# EAGLE schematic bbstghs_esp12F_module (EAGLE 5.09)
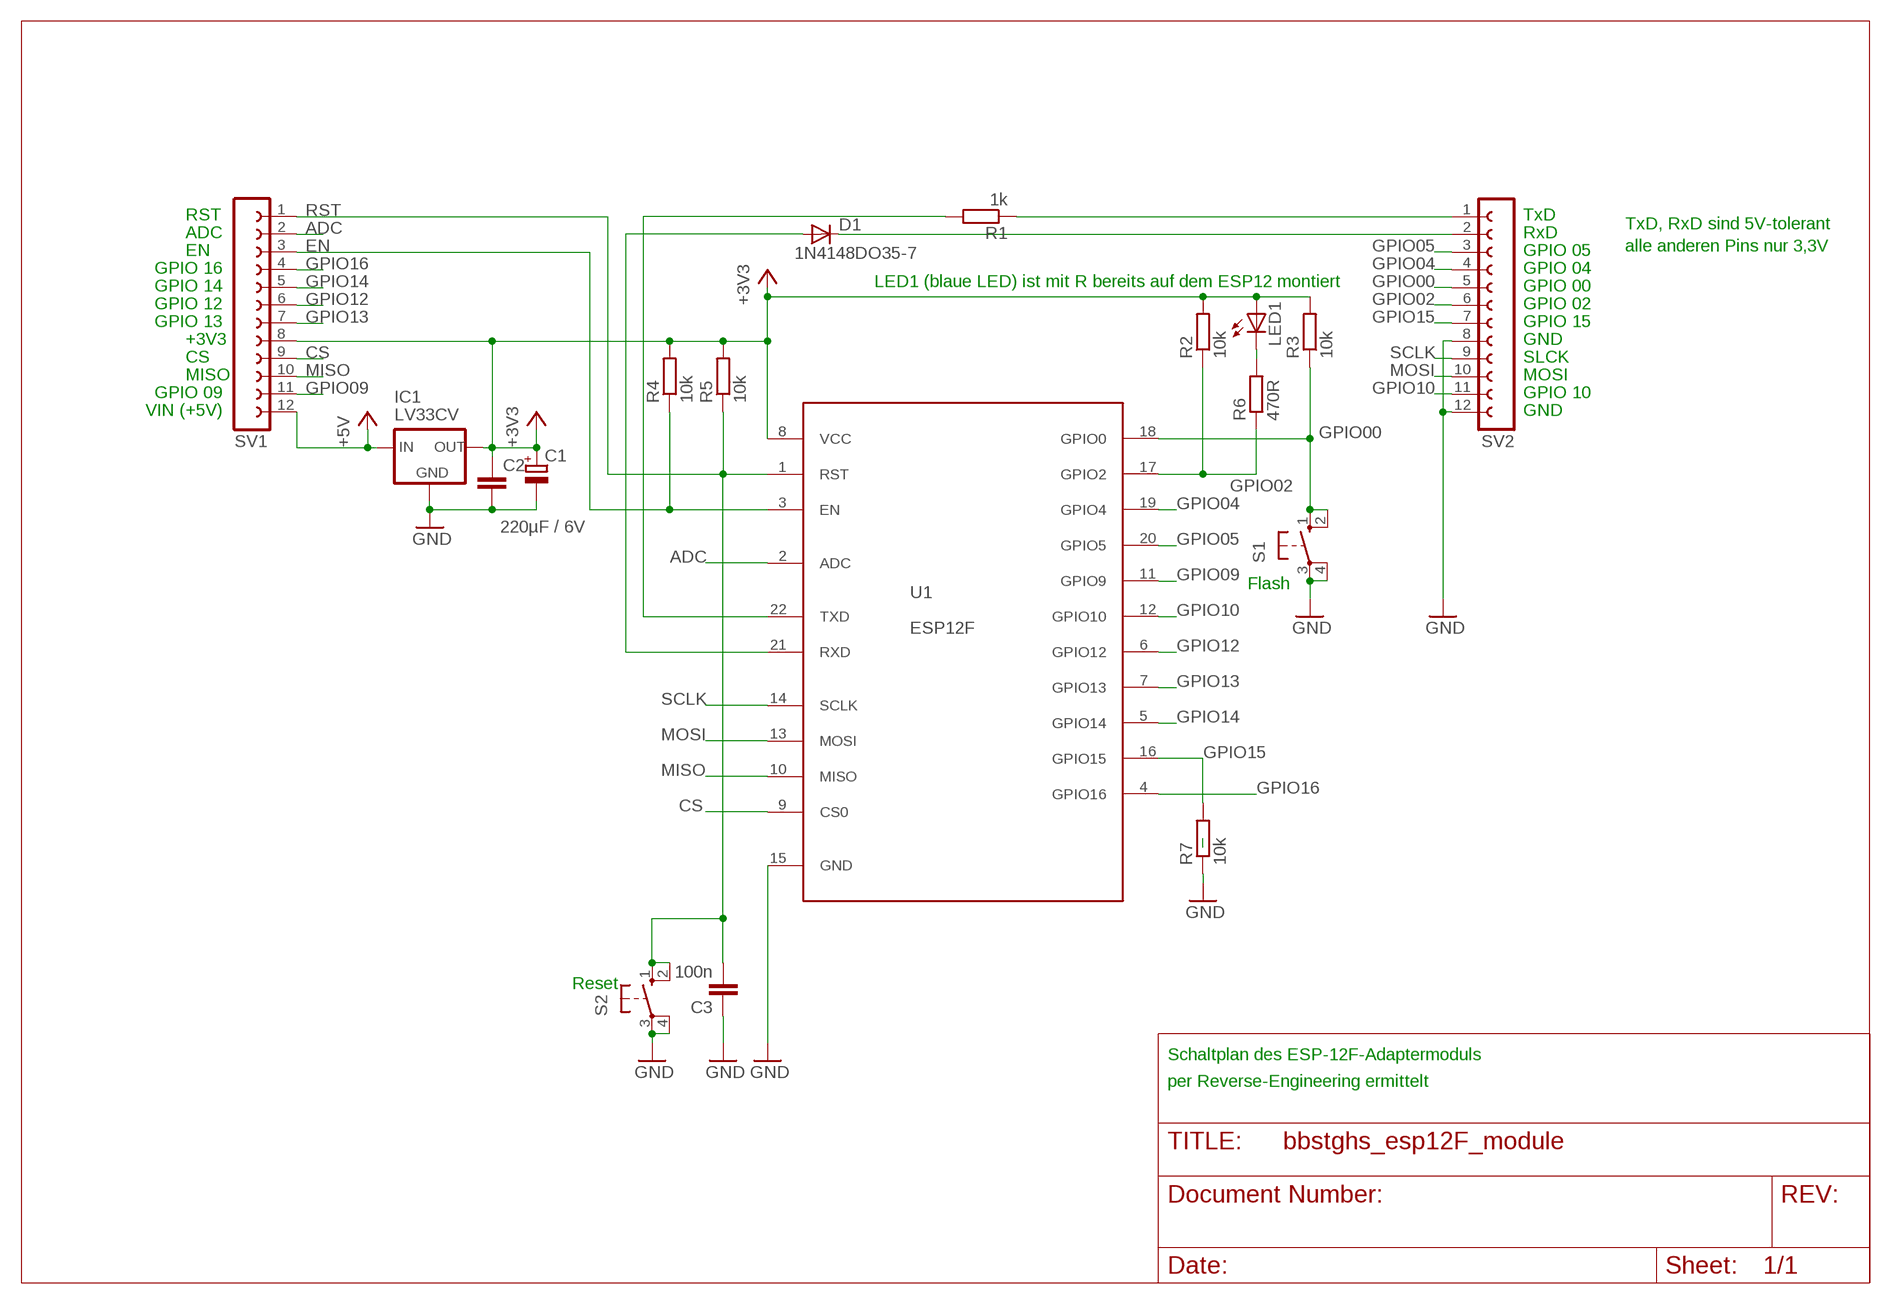
[diagram p0: schematic, sheet 1]

## Parts
C1  220µF / 6V  CPOL-EUE2-5  [E2-5]
C2  C-EU050-030X075  [C050-030X075]
C3  100n  C-EU050-030X075  [C050-030X075]
D1  1N4148DO35-7  [DO35-7]
IC1  LV33CV  78XXS  [78XXS]
LED1  LED3MM  [LED3MM]
R1  1k  R-EU_0207/10  [0207/10]
R2  10k  R-EU_0207/10  [0207/10]
R3  10k  R-EU_0207/10  [0207/10]
R4  10k  R-EU_0207/10  [0207/10]
R5  10k  R-EU_0207/10  [0207/10]
R6  470R  R-EU_0207/10  [0207/10]
R7  10k  R-EU_0207/10  [0207/10]
S1  10-XX  [B3F-10XX]
S2  10-XX  [B3F-10XX]
SV1  FE12-1  [FE12]
SV2  FE12-1  [FE12]
U1  ESP12F  [ESP12F]

## Nets
+3V3: C1.+ C2.1 IC1.OUT LED1.A R2.2 R3.2 R4.2 R5.2 SV1.8 U1.8(VCC)
+5V: IC1.IN SV1.12
ADC: SV1.2 U1.2(ADC)
CS: SV1.9 U1.9(CS0)
EN: R4.1 SV1.3 U1.3(EN)
GND: C1.- C2.2 C3.1 IC1.GND R7.1 S1.3(P) S1.4(P1) S2.3(P) S2.4(P1) SV2.8 SV2.12 U1.15(GND)
GPIO00: R3.1 S1.1(S) S1.2(S1) SV2.5 U1.18(GPIO0)
GPIO02: R2.1 R6.1 SV2.6 U1.17(GPIO2)
GPIO04: SV2.4 U1.19(GPIO4)
GPIO05: SV2.3 U1.20(GPIO5)
GPIO09: SV1.11 U1.11(GPIO9)
GPIO10: SV2.11 U1.12(GPIO10)
GPIO12: SV1.6 U1.6(GPIO12)
GPIO13: SV1.7 U1.7(GPIO13)
GPIO14: SV1.5 U1.5(GPIO14)
GPIO15: R7.2 SV2.7 U1.16(GPIO15)
GPIO16: SV1.4 U1.4(GPIO16)
MISO: SV1.10 U1.10(MISO)
MOSI: SV2.10 U1.13(MOSI)
N$4: LED1.K(C) R6.2
N$12: R1.1 SV2.1
N$13: R1.2 U1.22(TXD)
N$16: D1.C SV2.2
N$17: D1.A U1.21(RXD)
RST: C3.2 R5.1 S2.1(S) S2.2(S1) SV1.1 U1.1(RST)
SCLK: SV2.9 U1.14(SCLK)

## Notes on the sheet
- RST | TxD
- TxD, RxD sind 5V-tolerant
- ADC | RxD
- EN | GPIO 05 | alle anderen Pins nur 3,3V
- GPIO 16 | GPIO 04
- GPIO 14 | LED1 (blaue LED) ist mit R bereits auf dem ESP12 montiert | GPIO 00
- GPIO 12 | GPIO 02
- GPIO 13 | GPIO 15
- +3V3 | GND
- CS | SLCK
- MISO | MOSI
- GPIO 09 | GPIO 10
- VIN (+5V) | GND
- Flash
- Reset
- Schaltplan des ESP-12F-Adaptermoduls
- per Reverse-Engineering ermittelt

## Library data of the parts
C1 = bbstghs:CPOL-EU: POLARIZED CAPACITOR, European symbol
C2 C3 = bbstghs:C-EU: CAPACITOR, European symbol
D1 = bbstghs:1N4148: DIODE high speed (Philips)
IC1 = v-reg-3:78XXS: VOLTAGE REGULATOR
LED1 = bbstghs:LED: LED OSRAM: - CHIPLED LG R971, LG N971, LY N971, LG Q971, LY Q971, LO R971, LY R971 LH N974, LH R974 LS Q976, LO Q976, LY Q976 LO Q996 - Hyper CHIPLED LW Q18S LB Q993, LB Q99A, LB R99A - SideLED LS A670, LO A670, LY A670, LG A670, LP A670 LB A673, LV A673, LT A673, LW A673 LH A674 LY A675 LS A676, LA A676, LO A676, LY A676, LW A676 LS A679, LY A679, LG A679 - Hyper Micro SIDELED® LS Y876, LA Y876, LO Y876, LY Y876 LT Y87S - SmartLED LW L88C, LW L88S LB L89C, LB L89S, LG L890 LS L89K, LO L89K, LY L89K LS L896, LA L896, LO L896, LY L896 - TOPLED LS T670, LO T670, LY T670, LG T670, LP T670 LSG T670, LSP T670, LSY T670, LOP T670, LYG T670 LG T671, LOG T671, LSG T671 LB T673, LV T673, LT T673, LW T673 LH T674 LS T676, LA T676, LO T676, LY T676, LB T676, LH T676, LSB T676, LW T676 LB T67C, LV T67C, LT T67C, LS T67K, LO T67K, LY T67K, LW E67C LS E67B, LA E67B, LO E67B, LY E67B, LB E67C, LV E67C, LT E67C LW T67C LS T679, LY T679, LG T679 LS T770, LO T770, LY T770, LG T770, LP T770 LB T773, LV T773, LT T773, LW T773 LH T774 LS E675, LA E675, LY E675, LS T675 LS T776, LA T776, LO T776, LY T776, LB T776 LHGB T686 LT T68C, LB T68C - Hyper Mini TOPLED® LB M676 - Mini TOPLED Santana® LG M470 LS M47K, LO M47K, LY M47K Source: http://www.osram.convergy.de LUXEON: - LUMILED® LXK2-PW12-R00, LXK2-PW12-S00, LXK2-PW14-U00, LXK2-PW14-V00 LXK2-PM12-R00, LXK2-PM12-S00, LXK2-PM14-U00 LXK2-PE12-Q00, LXK2-PE12-R00, LXK2-PE12-S00, LXK2-PE14-T00, LXK2-PE14-U00 LXK2-PB12-K00, LXK2-PB12-L00, LXK2-PB12-M00, LXK2-PB14-N00, LXK2-PB14-P00, LXK2-PB14-Q00 LXK2-PR12-L00, LXK2-PR12-M00, LXK2-PR14-Q00, LXK2-PR14-R00 LXK2-PD12-Q00, LXK2-PD12-R00, LXK2-PD12-S00 LXK2-PH12-R00, LXK2-PH12-S00 LXK2-PL12-P00, LXK2-PL12-Q00, LXK2-PL12-R00 Source: www.luxeon.com KINGBRIGHT: KA-3528ASYC Source: www.kingbright.com
R1-R7 = bbstghs:R-EU_: RESISTOR, European symbol
S1 S2 = switch-omron:10-XX: OMRON SWITCH
SV1 SV2 = con-lsta:FE12-1: FEMALE HEADER
U1 = bbstghs:ESP12F